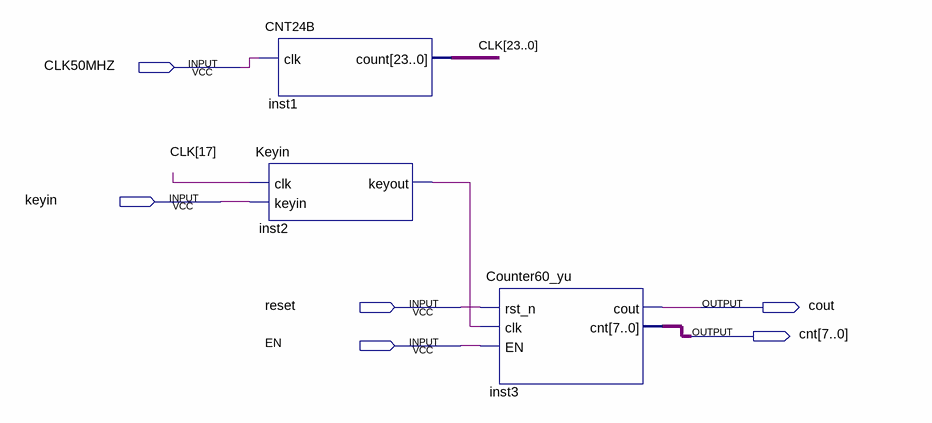
[diagram p0: schematic sheet]
// Quartus schematic key_better.bdf as structural Verilog: 3 symbols, 6 pins
module key_better (
  input  CLK50MHZ,
  input  keyin,
  input  reset,
  input  EN,
  output cout,
  output [7:0] cnt
);

  wire inst2_keyout;
  wire [23:0] CLK;

  CNT24B inst1 (.clk(CLK50MHZ), .count(CLK));
  Keyin inst2 (.clk(CLK[17]), .keyin(keyin), .keyout(inst2_keyout));
  Counter60_yu inst3 (.rst_n(reset), .clk(inst2_keyout), .EN(EN), .cout(cout), .cnt(cnt));
endmodule
